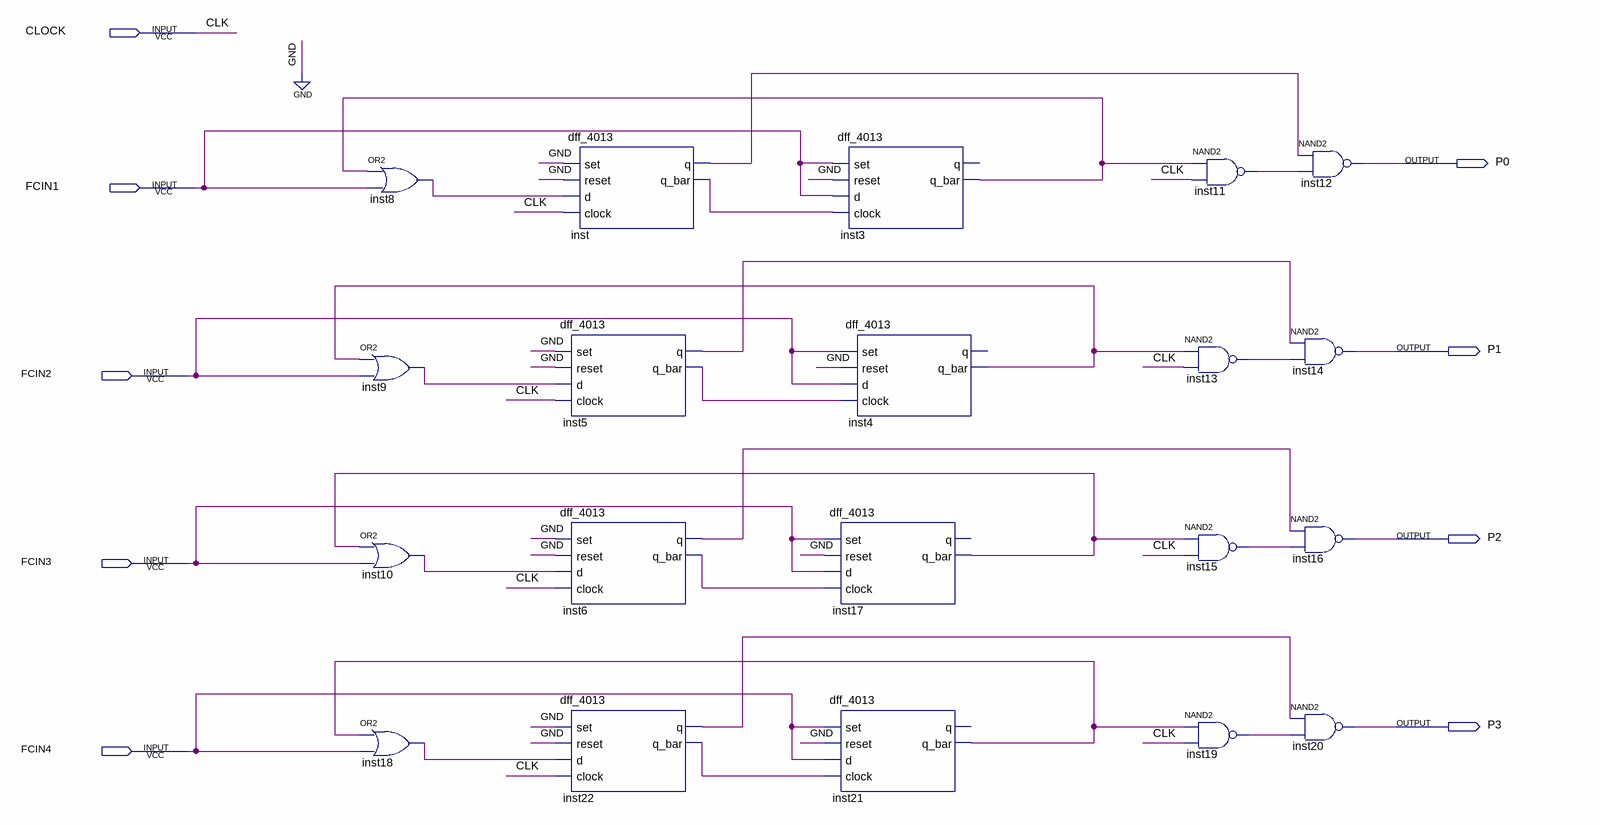
[diagram p0: schematic sheet]
// Quartus schematic multiple_input.bdf as structural Verilog: 20 symbols, 9 pins
module multiple_input (
  input  CLOCK,
  input  FCIN1,
  input  FCIN2,
  input  FCIN3,
  input  FCIN4,
  output P0,
  output P1,
  output P2,
  output P3
);

  wire inst3_q_bar, inst4_q_bar, inst5_q, inst5_q_bar, inst6_q, inst6_q_bar, inst8_out, inst9_out,
       inst10_out, inst11_out, inst13_out, inst15_out, inst17_q_bar, inst18_out, inst19_out, inst21_q_bar,
       inst22_q, inst22_q_bar, inst_q, inst_q_bar;

  or inst8 (inst8_out, inst3_q_bar, FCIN1);
  or inst9 (inst9_out, inst4_q_bar, FCIN2);
  or inst10 (inst10_out, inst17_q_bar, FCIN3);
  or inst18 (inst18_out, inst21_q_bar, FCIN4);
  dff_4013 inst (.set(1'b0), .reset(1'b0), .d(inst8_out), .clock(CLOCK), .q(inst_q), .q_bar(inst_q_bar));
  dff_4013 inst5 (.set(1'b0), .reset(1'b0), .d(inst9_out), .clock(CLOCK), .q(inst5_q), .q_bar(inst5_q_bar));
  dff_4013 inst6 (.set(1'b0), .reset(1'b0), .d(inst10_out), .clock(CLOCK), .q(inst6_q), .q_bar(inst6_q_bar));
  dff_4013 inst22 (.set(1'b0), .reset(1'b0), .d(inst18_out), .clock(CLOCK), .q(inst22_q), .q_bar(inst22_q_bar));
  dff_4013 inst3 (.set(FCIN1), .reset(1'b0), .d(FCIN1), .clock(inst_q_bar), .q_bar(inst3_q_bar));  // open: q
  dff_4013 inst4 (.set(FCIN2), .reset(1'b0), .d(FCIN2), .clock(inst5_q_bar), .q_bar(inst4_q_bar));  // open: q
  dff_4013 inst17 (.set(FCIN3), .reset(1'b0), .d(FCIN3), .clock(inst6_q_bar), .q_bar(inst17_q_bar));  // open: q
  dff_4013 inst21 (.set(FCIN4), .reset(1'b0), .d(FCIN4), .clock(inst22_q_bar), .q_bar(inst21_q_bar));  // open: q
  nand inst13 (inst13_out, inst4_q_bar, CLOCK);
  nand inst15 (inst15_out, inst17_q_bar, CLOCK);
  nand inst19 (inst19_out, inst21_q_bar, CLOCK);
  nand inst11 (inst11_out, inst3_q_bar, CLOCK);
  nand inst12 (P0, inst_q, inst11_out);
  nand inst14 (P1, inst5_q, inst13_out);
  nand inst16 (P2, inst6_q, inst15_out);
  nand inst20 (P3, inst22_q, inst19_out);

  // Other names for the same wires on the sheet: CLK = CLOCK
endmodule
